# EAGLE design LCD_boardv2 (EAGLE 6.6.0)
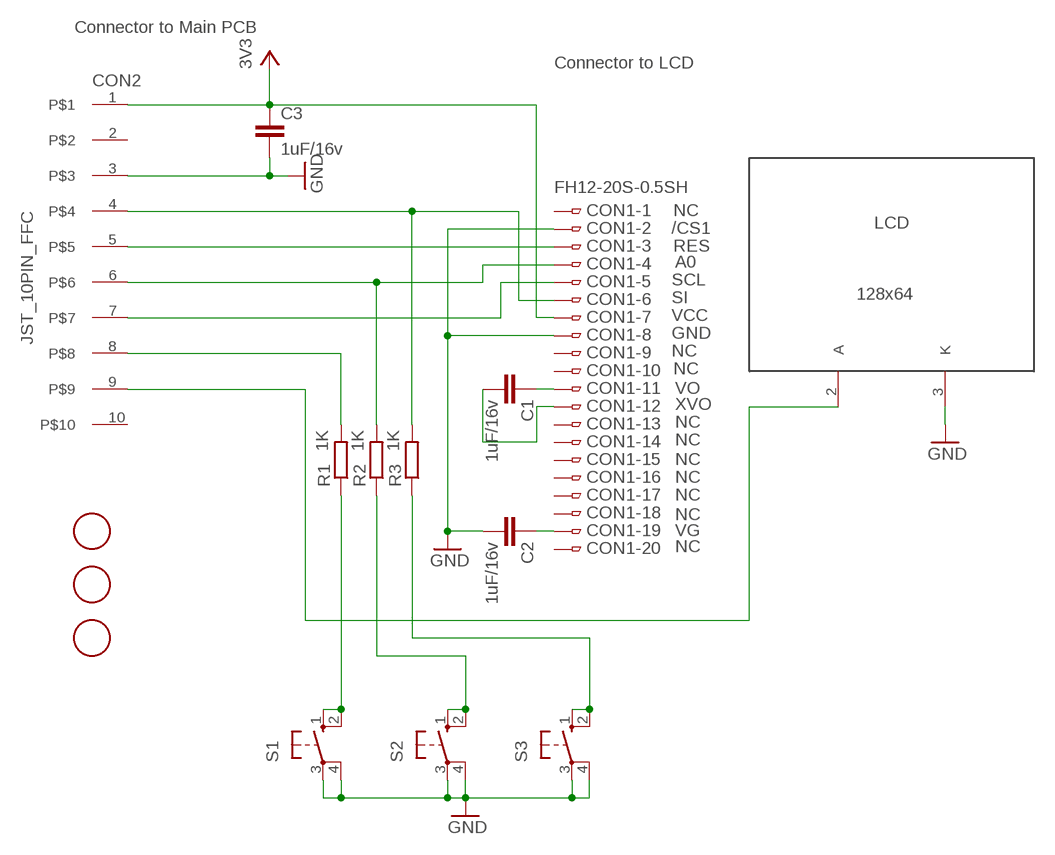
[diagram p0: schematic, sheet 1]

## Parts
C1  1uF/16v  C-EUC0805  [C0805]
C2  1uF/16v  C-EUC0805  [C0805]
C3  1uF/16v  C-EUC0805  [C0805]
CON1  FH12-20S-0.5SH  [FH12-20S-0.5SH]
CON2  JST_10PIN_FFC  [JST_10PIN_FFC]
R1  1K  R-EU_R0603  [R0603]
R2  1K  R-EU_R0603  [R0603]
R3  1K  R-EU_R0603  [R0603]
S1  10-XX  [B3F-10XX]
S2  10-XX  [B3F-10XX]
S3  10-XX  [B3F-10XX]
U$1  LCD_DEM128064  [LCD_DEM128064]
U$2  FIDUCIAL  [FIDUCIAL_1MM]
U$3  FIDUCIAL  [FIDUCIAL_1MM]
U$4  FIDUCIAL  [FIDUCIAL_1MM]

## Nets
GND: C2.2 C3.2 CON1.2 CON1.8 CON2.3 S1.3(P) S1.4(P1) S2.3(P) S2.4(P1) S3.3(P) S3.4(P1) U$1.3(K)
N$5: C1.1 CON1.11
N$6: C1.2 CON1.12
N$7: C2.1 CON1.19
N$8: CON1.6 CON2.4 R3.2
N$9: CON1.3 CON2.5
N$10: CON1.4 CON2.6 R2.2
N$11: CON1.5 CON2.7
N$12: R1.1 S1.1(S) S1.2(S1)
N$13: CON2.9 U$1.2(A)
N$14: R2.1 S2.1(S) S2.2(S1)
N$15: CON2.8 R1.2
N$16: R3.1 S3.1(S) S3.2(S1)
VCC: C3.1 CON1.7 CON2.1 ; supply symbol labelled 3V3
Unconnected: CON1.1 CON1.9 CON1.10 CON1.13 CON1.14 CON1.15 CON1.16 CON1.17 CON1.18 CON1.20 CON2.2 CON2.10

## Notes on the sheet
- Connector to Main PCB
- Connector to LCD
- NC
- /CS1
- RES
- A0
- SCL
- SI
- VCC
- GND
- NC
- NC
- VO
- XVO
- NC
- NC
- NC
- NC
- NC
- NC
- VG
- NC

## Library data of the parts
C1-C3 = rcl:C-EU: CAPACITOR, European symbol
CON1 = con-hirose:FH12-20S-0.5S: 0.5mm Pitch Connectors For FPC/FFC Source: Data sheet <http://www.hirose.co.jp/cataloge_hp/e58605370.pdf>; MPN: FH12-20S-0.5SH(55); OC_FARNELL: 1324549; OC_NEWARK: 34M6166
CON2 = Traco-TMLM04:JST_10PIN_FFC
R1-R3 = resistor:R-EU_: RESISTOR, European symbol
S1-S3 = switch-omron:10-XX: OMRON SWITCH; MPN: B3F-1000; OC_FARNELL: 176432; OC_NEWARK: 36M3542
U$1 = Traco-TMLM04:LCD_DEM128064
U$2-U$4 = adafruit:FIDUCIAL: For use by pick and place machines to calibrate the vision/machine, 1mm By microbuilder.eu

## Board
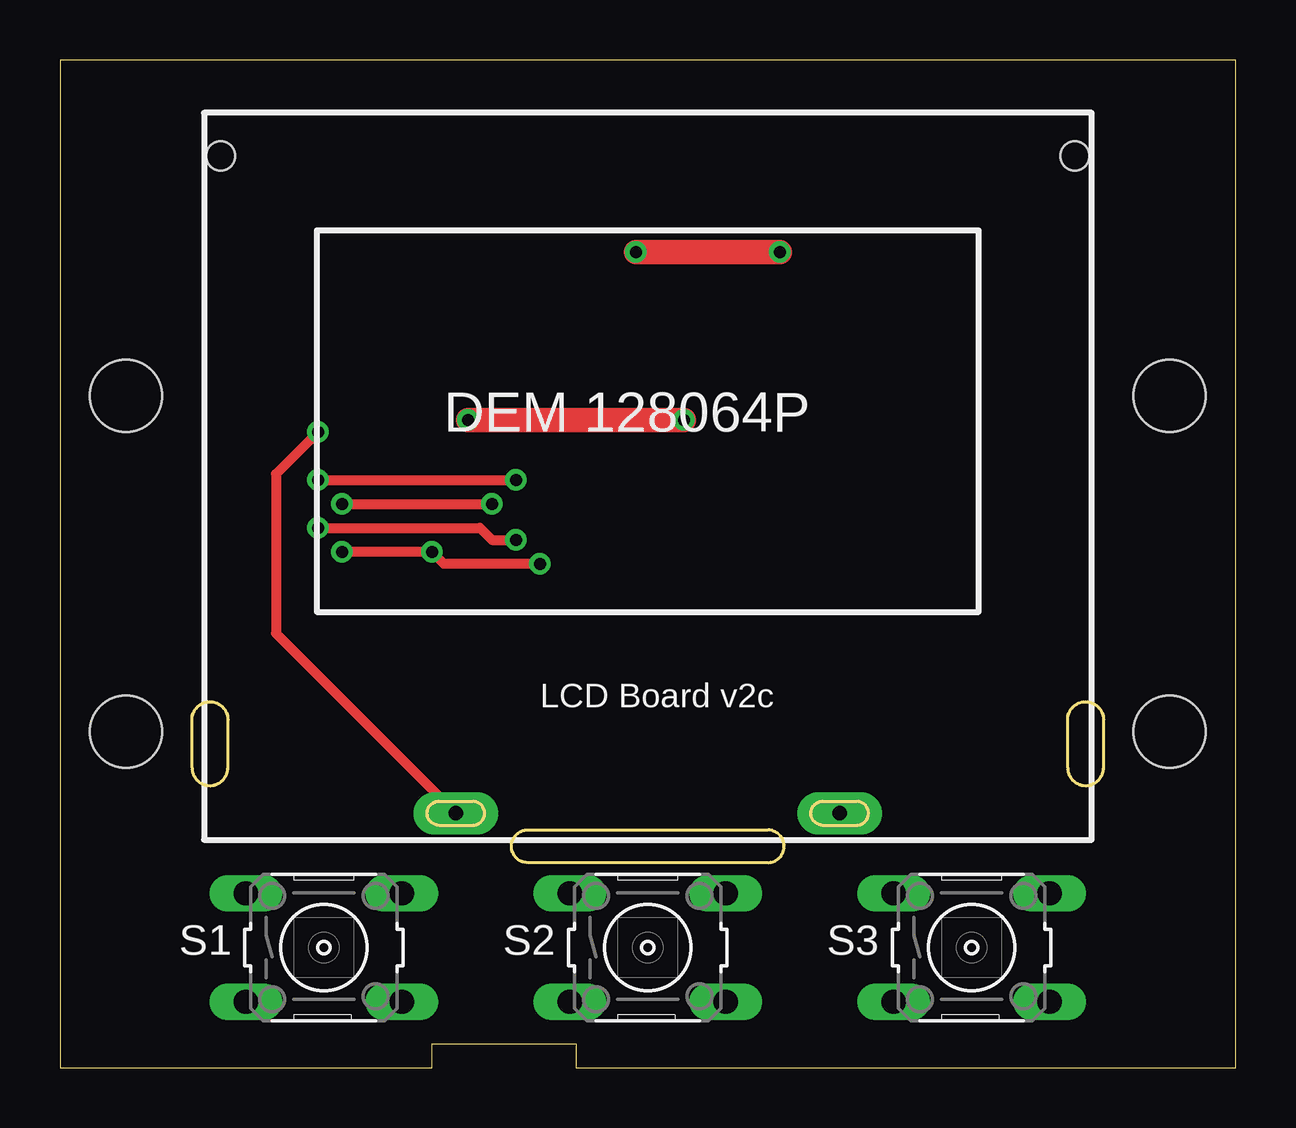
[diagram p1: board, top side]
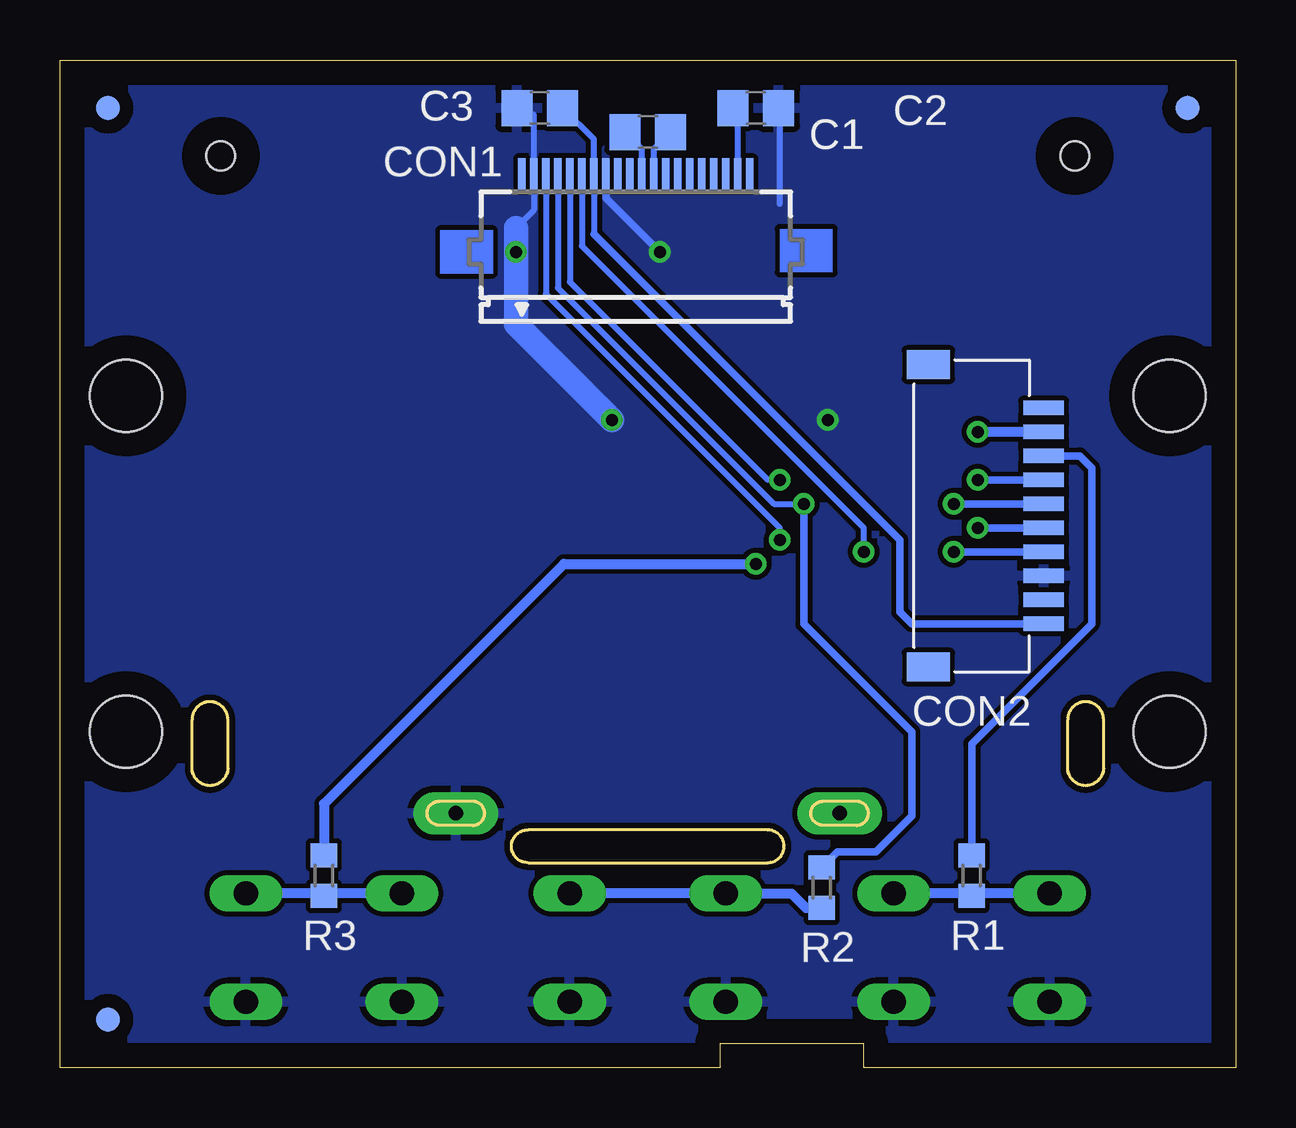
[diagram p2: board, bottom side, seen from below]

Size 49 x 42 mm. Coordinates in mm from the lower left corner, seen from the top.
Outline: 0,0 15.5,0 15.5,1 21.5,1 21.5,0 49,0 49,42 0,42 0,0
Copper layers (1*16): Top 0.035mm / dielectric 1.5mm / Bottom 0.035mm
Design rules "default *": minimum track width 10mil, minimum drill 0.5mm, track to track 8mil, track to pad 8mil, pad to pad 8mil, via to via 8mil, smd to smd 8mil, copper to edge 40mil, drill to drill 8mil, minimum pad ring 10mil, minimum via ring 8mil, stop-mask expansion 4mil, vias tented up to drill 25mil, thermal gap 10mil
Holes 3 mm at 2.75,28 46.25,28 46.25,14 2.75,14

### Footprints (pad centres in the part's own frame; a part is rotated, then mirrored left to right if it is on the bottom)
C0805 = smd 1.3 x 1.5: 1 -0.95,0; 2 0.95,0
FH12-20S-0.5SH = smd 0.3 x 1.3: 1 -4.75,3.25; 2 -4.25,3.25; 3 -3.75,3.25; 4 -3.25,3.25; 5 -2.75,3.25; 6 -2.25,3.25; 7 -1.75,3.25; 8 -1.25,3.25; 9 -0.75,3.25; 10 -0.25,3.25; 11 0.25,3.25; 12 0.75,3.25; 13 1.25,3.25; 14 1.75,3.25; 15 2.25,3.25; 16 2.75,3.25; 17 3.25,3.25; 18 3.75,3.25; 19 4.25,3.25; 20 4.75,3.25
JST_10PIN_FFC = smd 0.6 x 1.7: 1 -4.5,-3; 2 -3.5,-3; 3 -2.5,-3; 4 -1.5,-3; 5 -0.5,-3; 6 0.5,-3; 7 1.5,-3; 8 2.5,-3; 9 3.5,-3; 10 4.5,-3 | smd 1.2 x 1.8: 11 6.3,1.8; 13 -6.3,1.8
R0603 = smd 1 x 1.1: 1 -0.85,0; 2 0.85,0
B3F-10XX = drill 1.016 long: 1 -3.251,2.261; 2 3.251,2.261; 3 -3.251,-2.261; 4 3.251,-2.261
LCD_DEM128064 = drill 0.6 pad 1.778 long: 2 10.5,1.1; 3 26.5,1.1 | hole 1.2: 0.7,28.5; 36.3,28.5
FIDUCIAL_1MM = smd 1 x 1: 1 0,0

### Placement (x,y rotation side)
C1  24.5,39 0 bottom
C2  20,40 0 bottom
C3  29,40 180 bottom
CON1  25,34 0 bottom
CON2  11,23 90 bottom
R1  11,8 90 bottom
R2  17.25,7.5 90 bottom
R3  38,8 90 bottom
S1  11,5 0 top
S2  24.5,5 0 top
S3  38,5 0 top
U$1  6,9.5 0 top
U$2  2,40 0 bottom
U$3  47,40 90 bottom
U$4  47,2 0 bottom

### Tracks (layer width: path | path; a pad name or v marks a point on that pad's centre or on a via)
GND  (via drill 0.5)
  Top 1.016: v17,27 v26,27 | v24,34 v30,34
  Bottom 0.254: C3.2 29.25,39.7 CON1.2 29.25,35.75 30,35 | 19,36 19,39.95 C2.2
  Bottom 0.305: CON1.8 26.25,36.25 v24,34
  Bottom 1.016: v26,27 30,31 v30,34 30,35
  pour Bottom: 1,41 48,41 48,1 1,1
N$5
  Bottom 0.254: CON1.11 24.75,38.3 C1.1
N$6
  Bottom 0.254: CON1.12 24.25,38.3 C1.2
N$7
  Bottom 0.254: CON1.19 20.75,39.8 C2.1
N$8  (via drill 0.5)
  Top 0.406: v20,21 16,21 v15.5,21.5 v11.75,21.5
  Bottom 0.254: CON1.6 27.25,34.25 15.5,22.5 v15.5,21.5
  Bottom 0.305: CON2.4 v11.75,21.5
  Bottom 0.406: R3.2 38,11 28,21 v20,21
N$9  (via drill 0.5)
  Top 0.406: v10.75,22.5 17.5,22.5 18,22 v19,22
  Bottom 0.254: CON1.3 28.75,32.25 19,22.5 v19,22
  Bottom 0.305: v10.75,22.5 CON2.5
N$10  (via drill 0.5)
  Top 0.406: v11.75,23.5 v18,23.5
  Bottom 0.254: CON1.4 28.25,32.5 19.25,23.5 v18,23.5
  Bottom 0.305: CON2.6 v11.75,23.5 | v18,23.5 18,18.5 13.5,14 13.5,10.5 15,9 16.6,9 R2.2
  Bottom 0.406: 17,8.5 R2.2
N$11  (via drill 0.5)
  Top 0.406: v10.75,24.5 v19,24.5
  Bottom 0.254: CON1.5 27.75,32.75 19.5,24.5 v19,24.5
  Bottom 0.305: v10.75,24.5 CON2.7
N$12
  Bottom 0.406: S1.1 11,7.26 | 11,7.26 S1.2 | R1.1 11,7.26
N$13  (via drill 0.5)
  Top 0.406: v10.75,26.5 9,24.75 9,18.1 U$1.2
  Bottom 0.406: CON2.9 v10.75,26.5
N$14
  Bottom 0.406: S2.2 S2.1 21.24,7.25 18.5,7.25 17.9,6.65 R2.1
N$15
  Bottom 0.305: CON2.8 6.5,25.5 6,25 6,18.5 11,13.5 R1.2
N$16
  Bottom 0.406: S3.1 38,7.26 | 38,7.26 S3.2 | R3.1 38,7.26
VCC
  Bottom 0.254: 26.75,34.75 CON1.7 26.75,38.7 C3.1
  Bottom 0.305: CON2.1 13.5,18.5 14,19 14,22 26.75,34.75

### Text on the board
tNames: LCD Board v2c